# EAGLE schematic Chamber Standard (EAGLE 7.6.0)
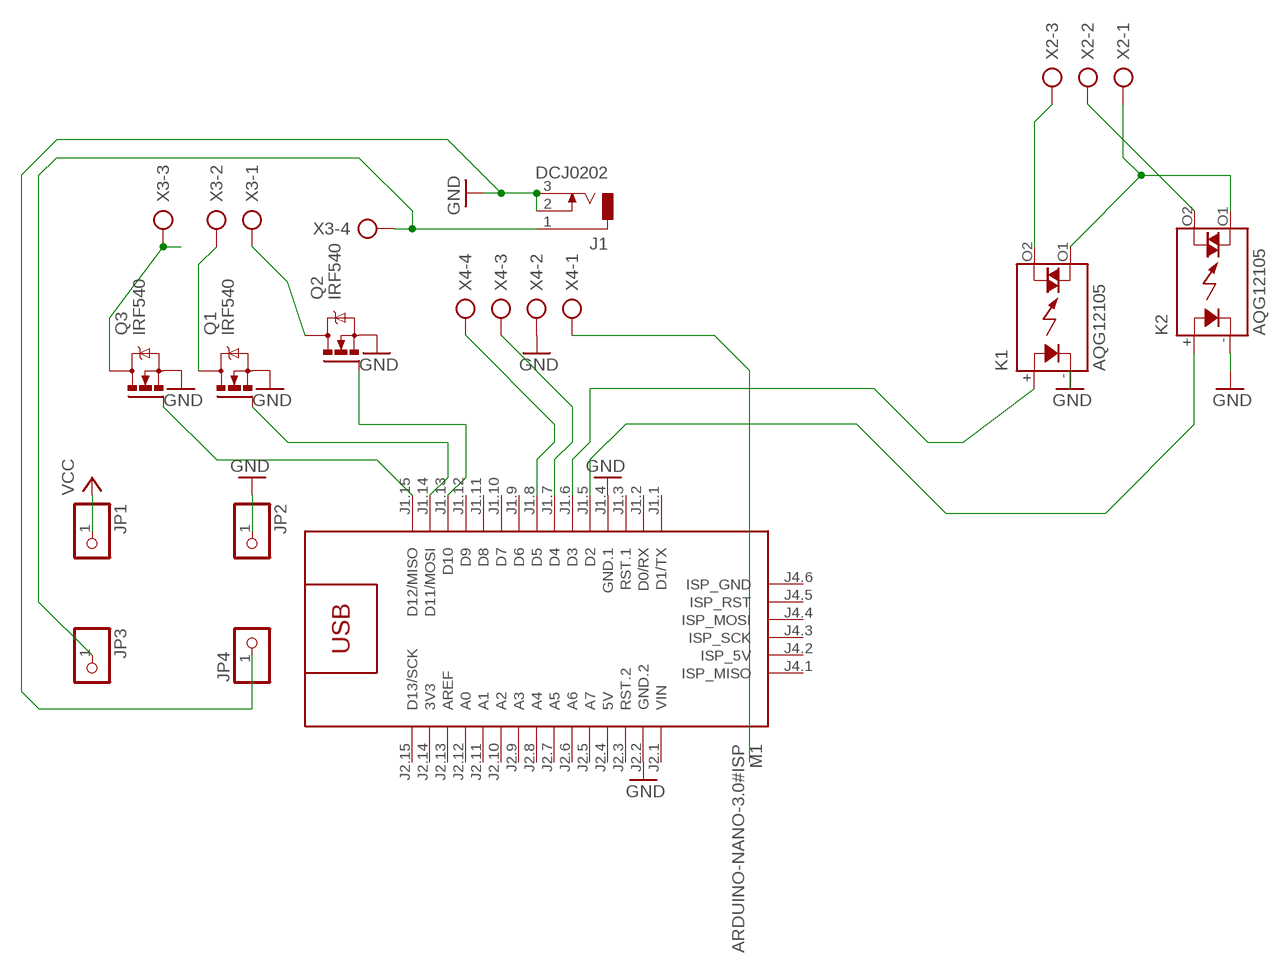
[diagram p0: schematic, sheet 1]

## Parts
J1  DCJ0202  [DCJ0202]
JP1  PINHD-1X1  [1X01]
JP2  PINHD-1X1  [1X01]
JP3  PINHD-1X1  [1X01]
JP4  PINHD-1X1  [1X01]
K1  AQG12105  [AQG]
K2  AQG12105  [AQG]
M1  ARDUINO-NANO-3.0#ISP  [ARDUINO-NANO-3.0#ISP]
Q1  IRF540  [TO220BV]
Q2  IRF540  [TO220BV]
Q3  IRF540  [TO220BV]
X2  AK300/3  [AK300/3]
X3  AK300/4  [AK300/4]
X4  AK300/4  [AK300/4]

## Nets
5V: X4.1
12V: J1.1 JP3.1 X3.4
GND: J1.2 J1.3 JP2.1 JP4.1 K1.-(K) K2.-(K) Q1.S Q2.S Q3.S X4.2
GND.1: M1.J2.2(GND.2) ; supply symbol labelled GND
GND.2: M1.J1.4(GND.1) ; supply symbol labelled GND
N$1: M1.J1.13(D10) Q2.G
N$2: M1.J1.15(D12/MISO) Q3.G
N$3: K2.O2(DS1) X2.2
N$4: Q3.D X3.3
N$5: Q1.D X3.2
N$6: Q2.D X3.1
N$7: K1.+(A) M1.J1.6(D3)
N$8: K2.+(A) M1.J1.5(D2)
N$9: K1.O1(DS2) K2.O1(DS2) X2.1
N$10: K1.O2(DS1) X2.3
N$13: M1.J1.7(D4) X4.3
N$14: M1.J1.8(D5) X4.4
N$15: M1.J1.14(D11/MOSI) Q1.G
VCC: JP1.1
Unconnected: M1.J1.1(D1/TX) M1.J1.2(D0/RX) M1.J1.3(RST.1) M1.J1.9(D6) M1.J1.10(D7) M1.J1.11(D8) M1.J1.12(D9) M1.J2.3(RST.2) M1.J2.5(A7) M1.J2.6(A6) M1.J2.7(A5) M1.J2.8(A4) M1.J2.9(A3) M1.J2.10(A2) M1.J2.11(A1) M1.J2.12(A0) M1.J2.13(AREF) M1.J2.15(D13/SCK) M1.J4.1(ISP_MISO) M1.J4.2(ISP_5V) M1.J4.3(ISP_SCK) M1.J4.4(ISP_MOSI) M1.J4.5(ISP_RST) M1.J4.6(ISP_GND)

## Power pins joined to a net without a drawn wire
3V3: M1.J2.14(3V3)
5V: M1.J2.4(5V)
VIN: M1.J2.1(VIN)

## Library data of the parts
J1 = con-jack:DCJ0202: DC POWER JACK Source: DCJ0202.pdf; OC_FARNELL: unknown; OC_NEWARK: unknown
JP1-JP4 = pinhead:PINHD-1X1: PIN HEADER
K1 K2 = relay:AQG*: SOLID STATE RELAY NAiS Zero-cross, Non zero-cross Source: http://www.mew-europe.com/.. en_ds_61611_0000.pdf; MF: AROMAT/ MATSUSHITA; MPN: AQG12105; OC_FARNELL: unknown; OC_NEWARK: 20J4759
M1 = diy-modules:ARDUINO-NANO-3.0#ISP: Arduino Nano 3.0 (and compatible devices) with ISP pads More details available here: https://www.arduino.cc/en/Main/ArduinoBoardNano Click here to find device on ebay.com <http://www.ebay.com/sch/arduino+nano>
Q1-Q3 = transistor-power:IRF540: HEXFET Power MOSFET
X2 = con-ptr500:AK300/3: CONNECTOR; OC_FARNELL: unknown; OC_NEWARK: unknown
X3 X4 = con-ptr500:AK300/4: CONNECTOR; OC_FARNELL: unknown; OC_NEWARK: unknown